# EAGLE design minime (EAGLE 7.2.0)
DESIGNER: BENJAMIN SHOCKLEY; REV: A
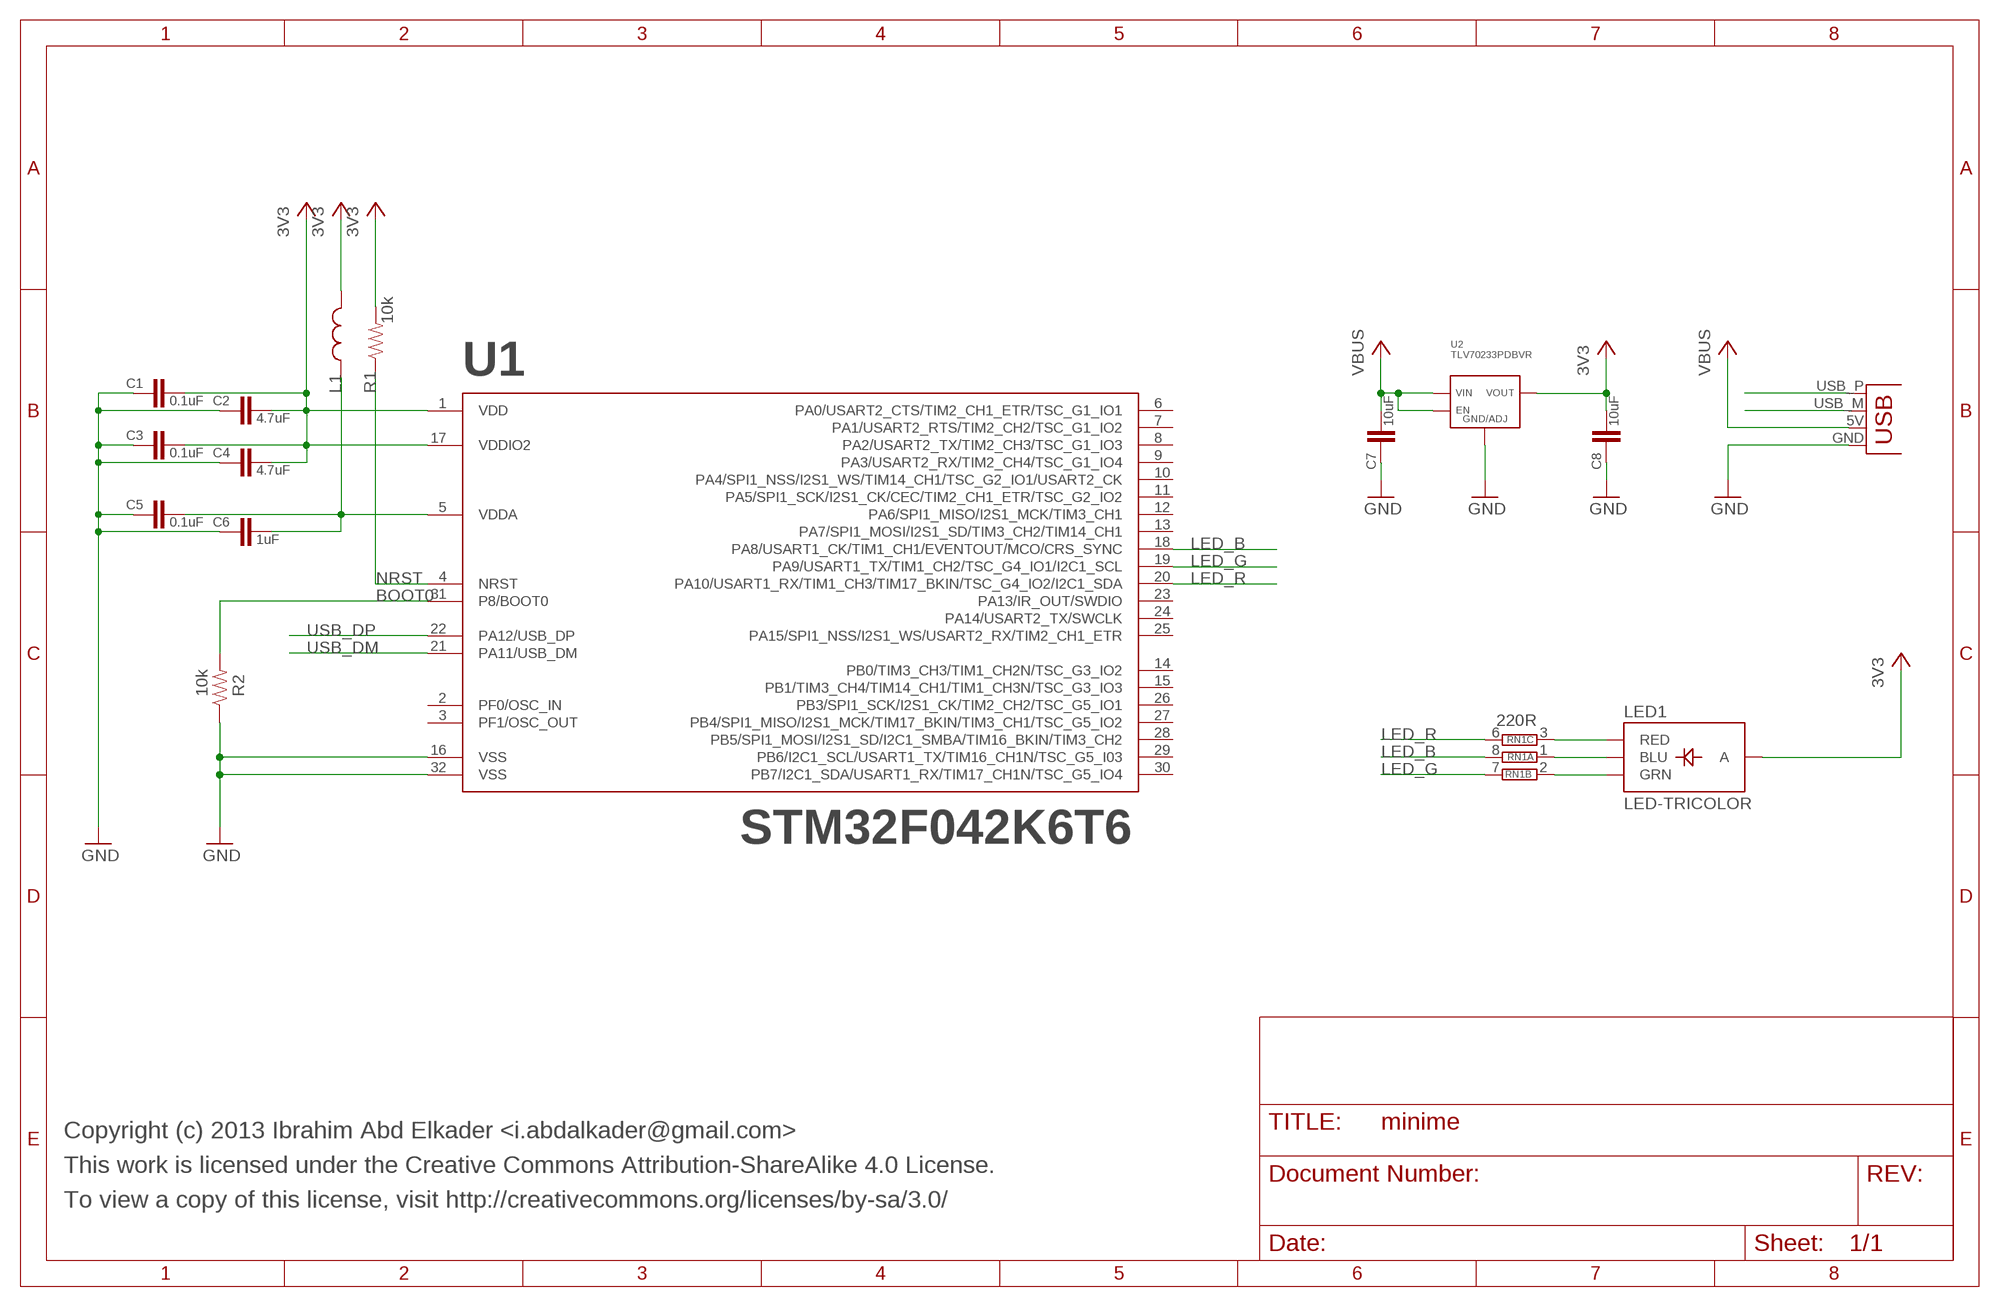
[diagram p0: schematic, sheet 1]

## Parts
C1  0.1uF  CAP0402-CAP  [0402-CAP]
C2  4.7uF  CAP0402-CAP  [0402-CAP]
C3  0.1uF  CAP0402-CAP  [0402-CAP]
C4  4.7uF  CAP0402-CAP  [0402-CAP]
C5  0.1uF  CAP0402-CAP  [0402-CAP]
C6  1uF  CAP0402-CAP  [0402-CAP]
C7  10uF  CAP0805  [0805]
C8  10uF  CAP0805  [0805]
L1  MPZ1608S181ATAH0  INDUCTOR0603  [0603]
LED1  LED-TRICOLOR  [LED-TRICOLOR-SMD-MF]
R1  10k  RESISTOR0402-RES  [0402-RES]
R2  10k  RESISTOR0402-RES  [0402-RES]
RN1  220R  4R-NEXBV8V  [EXBV8V]
U1  STM32F042K6T6  [LQFP32]
U2  TLV70233PDBVR  [SOT-23-5]
X1  SFE_USBPCB  [SFE_USB-A-PCB]

## Nets
3V3: C1.1 C2.1 C3.1 C4.1 C8.1 L1.2 LED1.A R1.2 U1.1(VDD) U1.17(VDDIO2) U2.P$5(VOUT)
BOOT0: R2.2 U1.31(P8/BOOT0)
GND: C1.2 C2.2 C3.2 C4.2 C5.2 C6.2 C7.2 C8.2 R2.1 U1.16(VSS) U1.32(VSS) U2.P$2(GND/ADJ) X1.GND
LED_B: RN1.8 U1.18(PA8/USART1_CK/TIM1_CH1/EVENTOUT/MCO/CRS_SYNC)
LED_G: RN1.7 U1.19(PA9/USART1_TX/TIM1_CH2/TSC_G4_IO1/I2C1_SCL)
LED_R: RN1.6 U1.20(PA10/USART1_RX/TIM1_CH3/TIM17_BKIN/TSC_G4_IO2/I2C1_SDA)
N$4: LED1.B(BLU) RN1.1
N$5: LED1.G(GRN) RN1.2
N$6: LED1.R(RED) RN1.3
NRST: R1.1 U1.4(NRST)
USB_DM: U1.21(PA11/USB_DM) X1.USB_M(D-)
USB_DP: U1.22(PA12/USB_DP) X1.USB_P(D+)
VBUS: C7.1 U2.P$1(VIN) U2.P$3(EN) X1.5V(VBUS)
VDDA: C5.1 C6.1 L1.1 U1.5(VDDA)
Unconnected: RN1.4 RN1.5 U1.2(PF0/OSC_IN) U1.3(PF1/OSC_OUT) U1.6(PA0/USART2_CTS/TIM2_CH1_ETR/TSC_G1_IO1) U1.7(PA1/USART2_RTS/TIM2_CH2/TSC_G1_IO2) U1.8(PA2/USART2_TX/TIM2_CH3/TSC_G1_IO3) U1.9(PA3/USART2_RX/TIM2_CH4/TSC_G1_IO4) U1.10(PA4/SPI1_NSS/I2S1_WS/TIM14_CH1/TSC_G2_IO1/USART2_CK) U1.11(PA5/SPI1_SCK/I2S1_CK/CEC/TIM2_CH1_ETR/TSC_G2_IO2) U1.12(PA6/SPI1_MISO/I2S1_MCK/TIM3_CH1) U1.13(PA7/SPI1_MOSI/I2S1_SD/TIM3_CH2/TIM14_CH1) U1.14(PB0/TIM3_CH3/TIM1_CH2N/TSC_G3_IO2) U1.15(PB1/TIM3_CH4/TIM14_CH1/TIM1_CH3N/TSC_G3_IO3) U1.23(PA13/IR_OUT/SWDIO) U1.24(PA14/USART2_TX/SWCLK) U1.25(PA15/SPI1_NSS/I2S1_WS/USART2_RX/TIM2_CH1_ETR) U1.26(PB3/SPI1_SCK/I2S1_CK/TIM2_CH2/TSC_G5_IO1) U1.27(PB4/SPI1_MISO/I2S1_MCK/TIM17_BKIN/TIM3_CH1/TSC_G5_IO2) U1.28(PB5/SPI1_MOSI/I2S1_SD/I2C1_SMBA/TIM16_BKIN/TIM3_CH2) U1.29(PB6/I2C1_SCL/USART1_TX/TIM16_CH1N/TSC_G5_I03) U1.30(PB7/I2C1_SDA/USART1_RX/TIM17_CH1N/TSC_G5_IO4)

## Notes on the sheet
- Copyright (c) 2013 Ibrahim Abd Elkader <i.abdalkader@gmail.com>
- This work is licensed under the Creative Commons Attribution-ShareAlike 4.0 License.
- To view a copy of this license, visit http://creativecommons.org/licenses/by-sa/3.0/

## Library data of the parts
C1-C8 = sfe:CAP: Capacitor Standard 0603 ceramic capacitor, and 0.1" leaded capacitor.
L1 = sfe:INDUCTOR: Inductors Basic Inductor/Choke - 0603 and 1206. Footprints are not proven and vary greatly between part numbers.
LED1 = sfe:LED-TRICOLOR: Tri-Color LED SMD Proven layout and schematic for triple color LED in SMD package - common anode. Spark Fun Electronics SKU : COM-07844
R1 R2 = sfe:RESISTOR: Resistor Basic schematic elements and footprints for 0603, 1206, and PTH resistors.
RN1 = resistor-dil:4R-N: Array Chip Resistor Source: RS Component / Phycomp; OC_FARNELL: unknown; OC_NEWARK: unknown
U1 = stm32:STM32F042K6T6
U2 = MF_IC_Power:TLV702: Manufacturer Part #: TLV702 Manufacturer: Texas Instruments Description: LDO Voltage Regulators
X1 = NRF24L01:SFE_USB: USB Connectors USB-B-PTH is fully proven SKU : PRT-00139 USB-miniB is fully proven SKU : PRT-00587 USB-A-PCB is untested. USB-A-H is throughly reviewed, but untested. Spark Fun Electronics SKU : PRT-00437 USB-B-SMT is throughly reviewed, but untested. Needs silkscreen touching up. USB-A-S has not been used/tested USB-MB-H has not been used/tested

## Board
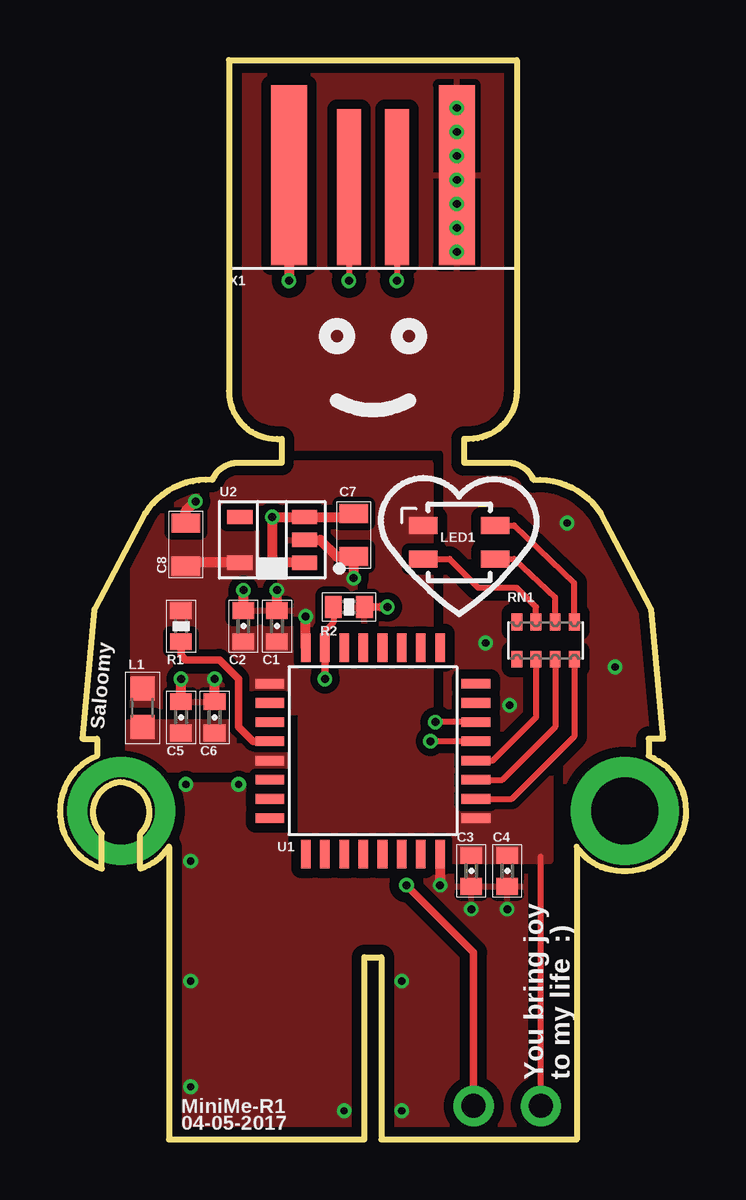
[diagram p1: board, top side]
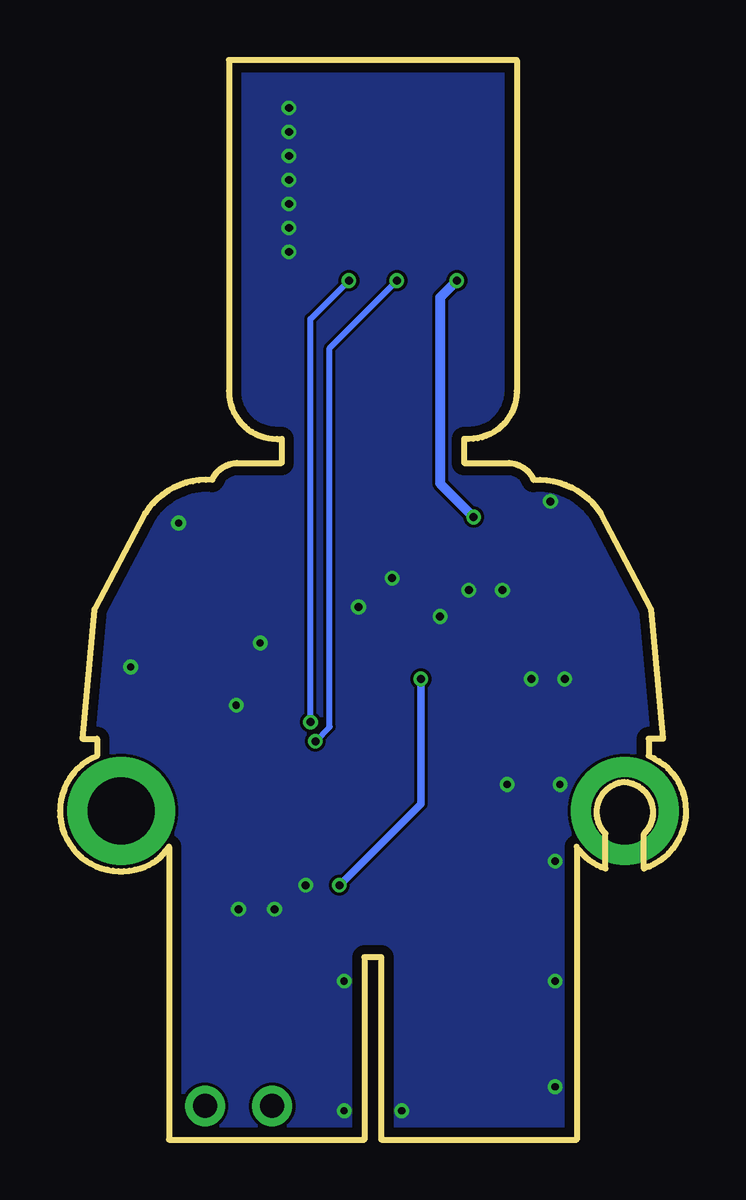
[diagram p2: board, bottom side, seen from below]

Size 26.1 x 45 mm. Coordinates in mm from the lower left corner, seen from the top.
Outline: 7.05,31.2 arc90 9.05,29.2 9.25,29.2 9.25,28.2 7.37,28.2 arc63 6.35,27.5 arc60 3.55,26.1 1.45,22.1 0.95,16.7 1.55,16.7 1.55,16 arc140 1.75,11.3 1.75,12.75 arc-132 2.55,14.9 arc-132 3.35,12.75 3.35,11.3 arc40 4.55,12.2 4.55,0 12.7,0 12.7,7.6 13.4,7.6 13.4,0 21.55,0 21.55,12.2 arc40 22.75,11.3 arc35 24.35,11.3 arc140 24.55,16 24.55,16.7 25.15,16.7 24.65,22.1 22.55,26.1 arc60 19.75,27.5 arc63 18.73,28.2 16.85,28.2 16.85,29.2 17.05,29.2 arc90 19.05,31.2 19.05,45 7.05,45 7.05,31.2
Copper layers (1*16): Top 0.035559375mm / dielectric 0.17018125mm / Bottom 0.035559375mm
Design rules "OSHPark-4layer *": minimum track width 5mil, minimum drill 10mil, track to track 5mil, track to pad 5mil, pad to pad 5mil, via to via 5mil, smd to smd 5mil, copper to edge 15mil, drill to drill 6mil, minimum pad ring 4mil, minimum via ring 4mil, stop-mask expansion 2.5mil, vias tented up to drill 3mil, thermal gap 10mil

### Footprints (pad centres in the part's own frame; a part is rotated, then mirrored left to right if it is on the bottom)
0402-CAP = smd 0.7 x 0.9: 1 -0.65,0; 2 0.65,0
0805 = smd 0.8 x 1.2: 1 -0.9,0; 2 0.9,0
0603 = smd 1 x 1: 1 -0.8,0; 2 0.8,0
LED-TRICOLOR-SMD-MF = smd 0.7 x 1.2: A 0.7,1.5; B 0.7,-1.5; G -0.7,-1.5; R -0.7,1.5
0402-RES = smd 0.7 x 0.9: 1 -0.65,0; 2 0.65,0
EXBV8V = smd 0.45 x 0.7: 1 -1.2,-0.775; 2 -0.4,-0.775; 3 0.4,-0.775; 4 1.2,-0.775; 5 1.2,0.775; 6 0.4,0.775; 7 -0.4,0.775; 8 -1.2,0.775
LQFP32 = smd 1.2 x 0.4: 1 -4.3,2.8; 2 -4.3,2; 3 -4.3,1.2; 4 -4.3,0.4; 5 -4.3,-0.4; 6 -4.3,-1.2; 7 -4.3,-2; 8 -4.3,-2.8; 17 4.3,-2.8; 18 4.3,-2; 19 4.3,-1.2; 20 4.3,-0.4; 21 4.3,0.4; 22 4.3,1.2; 23 4.3,2; 24 4.3,2.8 | smd 0.4 x 1.2: 9 -2.8,-4.3; 10 -2,-4.3; 11 -1.2,-4.3; 12 -0.4,-4.3; 13 0.4,-4.3; 14 1.2,-4.3; 15 2,-4.3; 16 2.8,-4.3; 25 2.8,4.3; 26 2,4.3; 27 1.2,4.3; 28 0.4,4.3; 29 -0.4,4.3; 30 -1.2,4.3; 31 -2,4.3; 32 -2.8,4.3
SOT-23-5 = smd 1.05 x 0.6: P$1 -1.35,0.95; P$2 -1.35,0; P$3 -1.35,-0.95; P$4 1.35,-0.95; P$5 1.35,0.95
SFE_USB-A-PCB = smd 7.5 x 1.5: 5V -0.2,-3.5; GND -0.2,3.5 | smd 6.5 x 1: USB_M 0.3,-1; USB_P 0.3,1

### Placement (x,y rotation side)
C1  9.05,21.4 90 top
C2  7.65,21.4 90 top
C3  17.15,11.2 270 top
C4  18.65,11.2 270 top
C5  5.05,17.6 90 top
C6  6.45,17.6 90 top
C7  12.25,25.2 270 top
C8  5.25,24.8 90 top
L1  3.45,18 90 top
LED1  16.65,24.9 90 top
R1  5.05,21.4 90 top
R2  12.05,22.2 180 top
RN1  20.25,20.8 180 top
U1  13.05,16.2 0 top
U2  8.85,25 180 top
X1  13.05,40 270 top

### Tracks (layer width: path | path; a pad name or v marks a point on that pad's centre or on a via)
3V3  (via drill 1 pad 1.68)
  Top 0.254: v20.05,1.4 20.05,11.8
  Top 0.406: U2.P$5 5.5,24.05 C8.1
  pour Top (isolate 0.305, rank 2, no thermals): 20.45,11.6 10.05,11.6 10.05,17.8 3.05,17.8 3.05,28.2 15.45,28.2 15.45,16 20.45,16
BOOT0  (via drill 0.33 pad 0.61, 1 pad 1.68)
  Top 0.254: U1.31 11.05,21.2 11.4,21.55 R2.2
  Top 0.305: U1.31 v11.05,19.2 | v17.25,1.4 17.25,7.8 v14.45,10.6
  Bottom 0.305: v11.05,19.2 11.05,14 v14.45,10.6
GND  (via drill 0.3 pad 0.61, 0.33 pad 0.61)
  Top 0.305: R2.1 v13.65,22.2
  Top 0.406: v12.25,23.4 C7.2 11.55,24.3 10.85,25 U2.P$2 | U1.32 v10.25,21.8 | U1.16 v15.85,10.6 | C2.2 v7.65,22.9 | C1.2 v9.05,22.9 | C5.2 v5.05,19.2 | C6.2 v6.45,19.2 | C8.2 5.25,26.2 v5.65,26.6
  other vias: 16.55,40 16.55,41 16.55,42 16.55,43 16.55,39 16.55,38 16.55,37 23.15,19.7 21.15,25.7 17.75,20.7 18.75,18.1 11.85,1.2 5.45,2.2 5.45,6.6 14.25,6.6 5.45,11.6 5.25,14.8 7.45,14.8 14.25,1.2 17.15,9.6 18.65,9.6
  pour Bottom (rank 3): 0.05,0 26.05,0 26.05,45 0.05,45
  pour Top (isolate 0.406, rank 3): 0.05,0 26.05,0 26.05,45 0.05,45
LED_B
  Top 0.254: U1.18 18.85,14.2 21.45,16.8 RN1.8
LED_G
  Top 0.254: U1.19 18.45,15 20.65,17.2 RN1.7
LED_R
  Top 0.254: U1.20 18.05,15.8 19.85,17.6 RN1.6
N$1  (via drill 2.8 pad 4.5)
  other vias: 2.55,13.7
N$2  (via drill 2.8 pad 4.5)
  other vias: 23.55,13.7
N$4
  Top 0.254: RN1.1 21.45,23.2 18.95,25.6 LED1.B
N$5
  Top 0.254: RN1.2 20.65,22.6 18.95,24.2 LED1.G
N$6
  Top 0.254: RN1.3 19.85,22.2 19.05,23 17.45,23 16.25,24.2 LED1.R
NRST
  Top 0.305: U1.4 8.05,16.6 7.45,17.2 7.45,19.2 6.65,20 5.25,20 5.05,20.2 R1.1
USB_DM  (via drill 0.33 pad 0.61)
  Top 0.254: X1.USB_M v12.05,35.8 | U1.21 v15.45,16.6
  Bottom 0.254: v15.45,16.6 14.85,17.2 14.85,33 v12.05,35.8
USB_DP  (via drill 0.33 pad 0.61)
  Top 0.254: X1.USB_P v14.05,35.8 | U1.22 v15.65,17.4
  Bottom 0.254: v15.65,17.4 15.65,34.2 v14.05,35.8
VBUS  (via drill 0.33 pad 0.61)
  Top 0.406: U2.P$1 8.85,24.05 v8.85,25.95 U2.P$3 12.1,25.95 C7.1 | X1.5V v9.55,35.8
  Bottom 0.406: v9.55,35.8 10.25,35.1 10.25,27.35 v8.85,25.95
VDDA
  pour Top (isolate 0.254, no thermals): 9.45,15.4 2.85,15.4 2.85,17.4 7.25,17.4 7.25,16.4 9.45,16.4

### Text on the board
tPlace: Saloomy | You bring joy | to my life :) | MiniMe-R1 | 04-05-2017